# Altium schematic sheet MCU.SchDoc
size A4; SheetNumber: 2; SheetTotal: 6
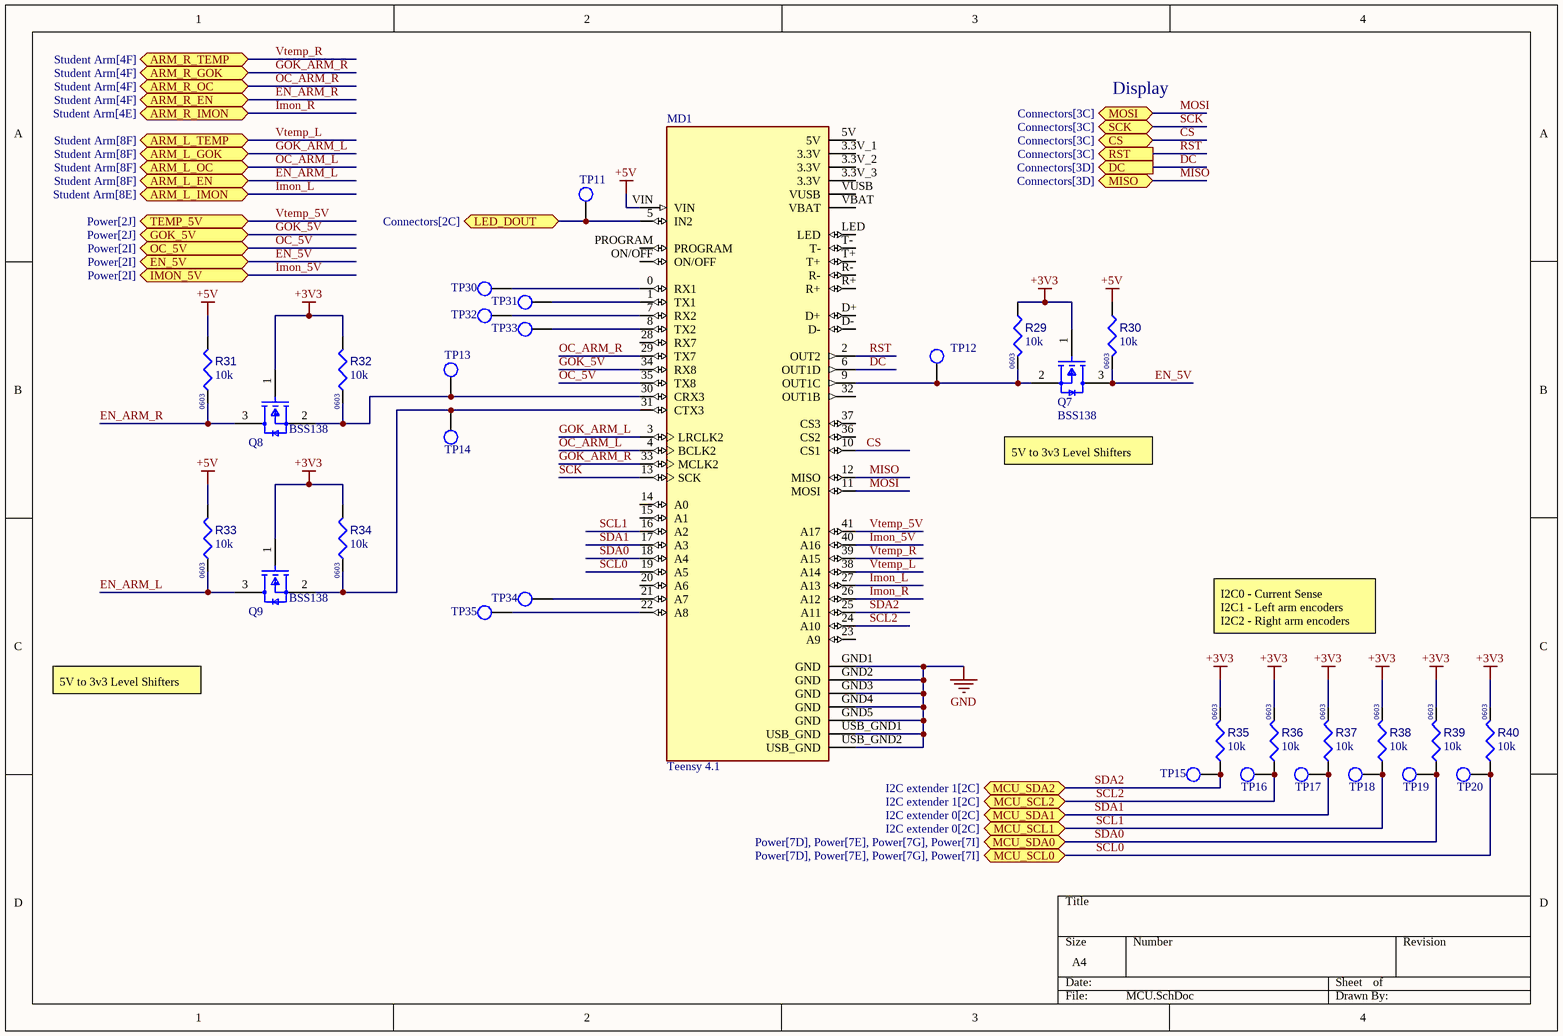
[diagram p0: MCU.SchDoc]

## Parts
MD1  Teensy 4.1  [FP-DEV-16771-MFG]
Q7  BSS138  [FP-318-08-IPC_B]
Q8  BSS138  [FP-318-08-IPC_B]
Q9  BSS138  [FP-318-08-IPC_B]
R29  value 10k  Case/Package: 0603  [RESC1608X55X25NL10T15]  (hidden comment: Resistor 10k +/-1% 0603 100 mW)
R30  value 10k  Case/Package: 0603  [RESC1608X55X25NL10T15]  (hidden comment: Resistor 10k +/-1% 0603 100 mW)
R31  value 10k  Case/Package: 0603  [RESC1608X55X25NL10T15]  (hidden comment: Resistor 10k +/-1% 0603 100 mW)
R32  value 10k  Case/Package: 0603  [RESC1608X55X25NL10T15]  (hidden comment: Resistor 10k +/-1% 0603 100 mW)
R33  value 10k  Case/Package: 0603  [RESC1608X55X25NL10T15]  (hidden comment: Resistor 10k +/-1% 0603 100 mW)
R34  value 10k  Case/Package: 0603  [RESC1608X55X25NL10T15]  (hidden comment: Resistor 10k +/-1% 0603 100 mW)
R35  value 10k  Case/Package: 0603  [RESC1608X55X25NL10T15]  (hidden comment: Resistor 10k +/-1% 0603 100 mW)
R36  value 10k  Case/Package: 0603  [RESC1608X55X25NL10T15]  (hidden comment: Resistor 10k +/-1% 0603 100 mW)
R37  value 10k  Case/Package: 0603  [RESC1608X55X25NL10T15]  (hidden comment: Resistor 10k +/-1% 0603 100 mW)
R38  value 10k  Case/Package: 0603  [RESC1608X55X25NL10T15]  (hidden comment: Resistor 10k +/-1% 0603 100 mW)
R39  value 10k  Case/Package: 0603  [RESC1608X55X25NL10T15]  (hidden comment: Resistor 10k +/-1% 0603 100 mW)
R40  value 10k  Case/Package: 0603  [RESC1608X55X25NL10T15]  (hidden comment: Resistor 10k +/-1% 0603 100 mW)
TP11  RCUCTE  [FP-S2761-46R-MFG]  (value not drawn)
TP12  RCUCTE  [FP-S2761-46R-MFG]  (value not drawn)
TP13  RCUCTE  [FP-S2761-46R-MFG]  (value not drawn)
TP14  RCUCTE  [FP-S2761-46R-MFG]  (value not drawn)
TP15  RCUCTE  [FP-S2761-46R-MFG]  (value not drawn)
TP16  RCUCTE  [FP-S2761-46R-MFG]  (value not drawn)
TP17  RCUCTE  [FP-S2761-46R-MFG]  (value not drawn)
TP18  RCUCTE  [FP-S2761-46R-MFG]  (value not drawn)
TP19  RCUCTE  [FP-S2761-46R-MFG]  (value not drawn)
TP20  RCUCTE  [FP-S2761-46R-MFG]  (value not drawn)
TP30  RCUCTE  [FP-S2761-46R-MFG]  (value not drawn)
TP31  RCUCTE  [FP-S2761-46R-MFG]  (value not drawn)
TP32  RCUCTE  [FP-S2761-46R-MFG]  (value not drawn)
TP33  RCUCTE  [FP-S2761-46R-MFG]  (value not drawn)
TP34  RCUCTE  [FP-S2761-46R-MFG]  (value not drawn)
TP35  RCUCTE  [FP-S2761-46R-MFG]  (value not drawn)

## Ports
ARM_L_EN (bidir, see Student Arm[8F]), ARM_L_GOK (bidir, see Student Arm[8F]), ARM_L_IMON (bidir, see Student Arm[8E]), ARM_L_OC (bidir, see Student Arm[8F]), ARM_L_TEMP (bidir, see Student Arm[8F]), ARM_R_EN (bidir, see Student Arm[4F]), ARM_R_GOK (bidir, see Student Arm[4F]), ARM_R_IMON (bidir, see Student Arm[4E]), ARM_R_OC (bidir, see Student Arm[4F]), ARM_R_TEMP (bidir, see Student Arm[4F]), CS (bidir, see Connectors[3C]), DC (out, see Connectors[3D]), EN_5V (bidir, see Power[2I]), GOK_5V (bidir, see Power[2J]), IMON_5V (bidir, see Power[2I]), LED_DOUT (bidir, see Connectors[2C]), MCU_SCL0 (bidir, see Power[7D], Power[7E], Power[7G], Power[7I]), MCU_SCL1 (bidir, see I2C extender 0[2C]), MCU_SCL2 (bidir, see I2C extender 1[2C]), MCU_SDA0 (bidir, see Power[7D], Power[7E], Power[7G], Power[7I]), MCU_SDA1 (bidir, see I2C extender 0[2C]), MCU_SDA2 (bidir, see I2C extender 1[2C]), MISO (bidir, see Connectors[3D]), MOSI (bidir, see Connectors[3C]), OC_5V (bidir, see Power[2I]), RST (out, see Connectors[3C]), SCK (bidir, see Connectors[3C]), TEMP_5V (bidir, see Power[2J])

## Nets
+3V3: Q7.1(G) Q8.1(G) Q9.1(G) R29.2 R32.2 R34.2 R35.2 R36.2 R37.2 R38.2 R39.2 R40.2
+5V: MD1.VIN R30.2 R31.2 R33.2
GND: MD1.GND1(GND) MD1.GND2(GND) MD1.GND3(GND) MD1.GND4(GND) MD1.GND5(GND) MD1.USB_GND1(USB_GND) MD1.USB_GND2(USB_GND)
CS: MD1.10(CS1) ; port CS
DC: MD1.6(OUT1D) ; port DC
EN_5V: Q7.3(D) R30.1 ; port EN_5V
EN_ARM_L: Q9.3(D) R33.1 ; port ARM_L_EN
EN_ARM_R: Q8.3(D) R31.1 ; port ARM_R_EN
GOK_5V: MD1.34(RX8) ; port GOK_5V
GOK_ARM_L: MD1.3(LRCLK2) ; port ARM_L_GOK
GOK_ARM_R: MD1.33(MCLK2) ; port ARM_R_GOK
Imon_5V: MD1.40(A16) ; port IMON_5V
Imon_L: MD1.27(A13) ; port ARM_L_IMON
Imon_R: MD1.26(A12) ; port ARM_R_IMON
LED_DOUT: MD1.5(IN2) TP11.1 ; port LED_DOUT
MISO: MD1.12(MISO) ; port MISO
MOSI: MD1.11(MOSI) ; port MOSI
OC_5V: MD1.35(TX8) ; port OC_5V
OC_ARM_L: MD1.4(BCLK2) ; port ARM_L_OC
OC_ARM_R: MD1.29(TX7) ; port ARM_R_OC
RST: MD1.2(OUT2) ; port RST
SCK: MD1.13(SCK) ; port SCK
SCL0: MD1.19(A5) R40.1 TP20.1 ; port MCU_SCL0
SCL1: MD1.16(A2) R38.1 TP18.1 ; port MCU_SCL1
SCL2: MD1.24(A10) R36.1 TP16.1 ; port MCU_SCL2
SDA0: MD1.18(A4) R39.1 TP19.1 ; port MCU_SDA0
SDA1: MD1.17(A3) R37.1 TP17.1 ; port MCU_SDA1
SDA2: MD1.25(A11) R35.1 TP15.1 ; port MCU_SDA2
Vtemp_5V: MD1.41(A17) ; port TEMP_5V
Vtemp_L: MD1.38(A14) ; port ARM_L_TEMP
Vtemp_R: MD1.39(A15) ; port ARM_R_TEMP
NetMD1_0: MD1.0(RX1) TP30.1
NetMD1_1: MD1.1(TX1) TP31.1
NetMD1_7: MD1.7(RX2) TP32.1
NetMD1_8: MD1.8(TX2) TP33.1
NetMD1_9: MD1.9(OUT1C) Q7.2(S) R29.1 TP12.1
NetMD1_21: MD1.21(A7) TP34.1
NetMD1_22: MD1.22(A8) TP35.1
NetMD1_30: MD1.30(CRX3) Q8.2(S) R32.1 TP13.1
NetMD1_31: MD1.31(CTX3) Q9.2(S) R34.1 TP14.1

Not connected (* = marked no-connect by the designer): MD1 3.3V_1(3.3V) 3.3V_2(3.3V) 3.3V_3(3.3V) 5V 14(A0) 15(A1) 20(A6) 23(A9) 28(RX7) 32(OUT1B) 36(CS2) 37(CS3) D+ D- LED ON/OFF PROGRAM R+ R- T+ T- VBAT VUSB

## Notes on the sheet
- Display
- 5V to 3v3 Level Shifters
- I2C0 - Current Sense
  I2C1 - Left arm encoders
  I2C2 - Right arm encoders

## Library data of the parts
MD1 = CMP-020-00023-1: iMXRT1062 Microcontroller Development Board 600MHz CPU 1GB RAM 8MB Flash
Q7-Q9 = CMP-07173-000101-1: MOSFET N-CH 50V 220MA SOT-23; Turn-Off Delay Time: 20ns; Element Configuration: Single; Rds On Max: 3.5R; Gate to Source Voltage (Vgs): 20V; Threshold Voltage: 1.3V; Number of Elements: 1; Power Dissipation: 360mW; Rise Time: 9ns; Turn-On Delay Time: 2.5ns; Input Capacitance: 27pF; On-State Resistance: 6R; Lead Free: Lead Free; Length: 2.92mm; Width: 1.3mm; Drain to Source Breakdown Voltage: 50V; Min Operating Temperature: -55°C; REACH SVHC: No SVHC; Packaging: Tape and Reel; Radiation Hardening: No; Height: 0.93mm; Drain to Source Voltage (Vdss): 50V; Current Rating: 220mA; Voltage Rating (DC): 50V; Weight: 0.03g; Continuous Drain Current (ID): 220mA; Number of Pins: 3; Nominal Vgs: 1.3V; Max Power Dissipation: 360mW; Fall Time: 9ns; Drain to Source Resistance: 3.5R; Contact Plating: Tin; Case/Package: SOT-23; Package Quantity: 1; Dual Supply Voltage: 50V; Mount: Surface Mount; Termination: SMD/SMT; Max Operating Temperature: 150°C
R29-R40 = CMP-009-00017-7: Chip Resistor, 10 KOhm, +/- 1%, 01 W, -55 to 155 degC, 0603 (1608 Metric); Voltage Rating: 50V; Power: 100mW; RoHS Compliant: True; Min Operating Temperature: -55°C; Pins: 2; Mounting Technology: SM; Max Operating Temperature: 155°C; Tolerance: 1%
TP11-TP20 TP30-TP35 = CMP-002-00072-5: Test point; Connector Type: Interconnection Device; Pins: 2; Max Operating Temperature: 125°C; Case/Package: 0603; Mounting Technology: Surface Mount; RoHS Compliant: Yes; Min Operating Temperature: -55°C